# EAGLE design 16-pin SOIC+TSSOP (EAGLE 6.2)
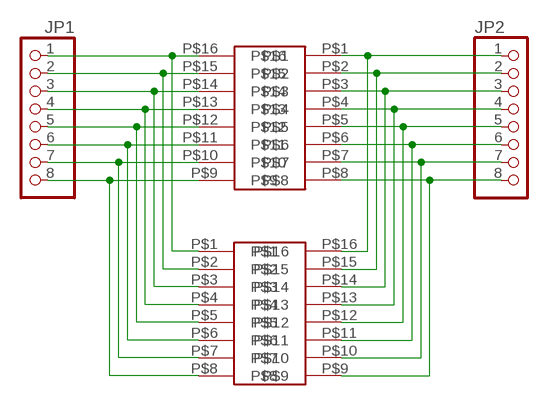
[diagram p0: schematic, sheet 1]

## Parts
JP1  PADS-8CLEANBIG  [PADS-8]
JP2  PADS-8CLEANBIG  [PADS-8]
U$1  16-PINSOIC-NW  [SO16-NW]
U$2  16-PINTSSOP-NW  [TSSOP16-NW]

## Nets
N$1: JP1.1 U$1.P$1 U$2.P$16
N$2: JP1.2 U$1.P$2 U$2.P$15
N$3: JP1.3 U$1.P$3 U$2.P$14
N$4: JP1.4 U$1.P$4 U$2.P$13
N$6: JP1.6 U$1.P$6 U$2.P$11
N$7: JP1.7 U$1.P$7 U$2.P$10
N$8: JP1.8 U$1.P$8 U$2.P$9
N$9: JP2.1 U$1.P$16 U$2.P$1
N$10: JP2.2 U$1.P$15 U$2.P$2
N$11: JP2.3 U$1.P$14 U$2.P$3
N$12: JP2.4 U$1.P$13 U$2.P$4
N$13: JP2.5 U$1.P$12 U$2.P$5
N$14: JP2.6 U$1.P$11 U$2.P$6
N$15: JP2.7 U$1.P$10 U$2.P$7
N$16: JP2.8 U$1.P$9 U$2.P$8
N$17: JP1.5 U$1.P$5 U$2.P$12

## Library data of the parts
JP1 JP2 = breakouts:PADS-8: PIN HEADER
U$1 U$2 = breakouts:16-PIN

## Board
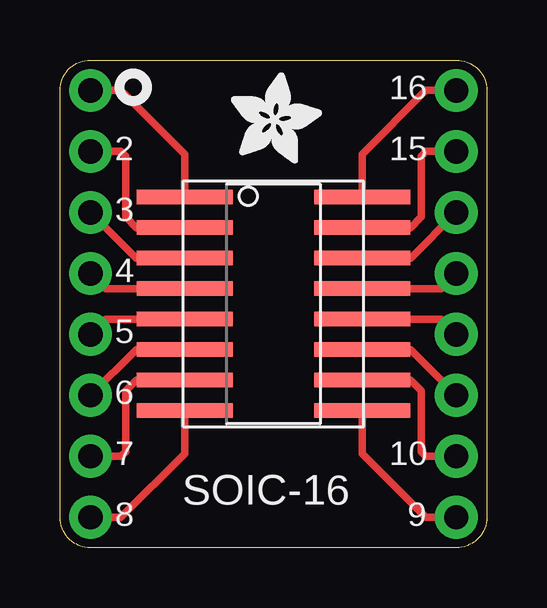
[diagram p1: board, top side]
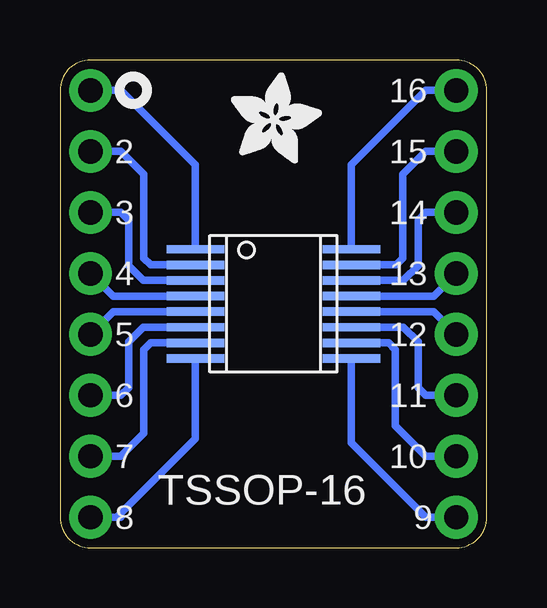
[diagram p2: board, bottom side, seen from below]

Size 17.78 x 20.32 mm. Coordinates in mm from the lower left corner, seen from the top.
Outline: 0,1.27 0,19.05 arc-90 1.27,20.32 16.51,20.32 arc-90 17.78,19.05 17.78,1.27 arc-90 16.51,0 1.27,0 arc-90 0,1.27
Copper layers (1*16): Top 0.035mm / dielectric 1.5mm / Bottom 0.035mm
Design rules: minimum track width 10mil, minimum drill 16mil, track to track 8mil, track to pad 8mil, pad to pad 8mil, via to via 8mil, smd to smd 8mil, copper to edge 10mil, drill to drill 8mil, minimum pad ring 10mil, minimum via ring 8mil, stop-mask expansion 4mil, vias tented up to drill 20mil, thermal gap 10mil

### Footprints (pad centres in the part's own frame; a part is rotated, then mirrored left to right if it is on the bottom)
PADS-8 = drill 1.016 pad 1.778: 1 -8.89,0; 2 -6.35,0; 3 -3.81,0; 4 -1.27,0; 5 1.27,0; 6 3.81,0; 7 6.35,0; 8 8.89,0
SO16-NW = smd 4 x 0.6: P$1 -3.7,4.445; P$2 -3.7,3.175; P$3 -3.7,1.905; P$4 -3.7,0.635; P$5 -3.7,-0.635; P$6 -3.7,-1.905; P$7 -3.7,-3.175; P$8 -3.7,-4.445; P$9 3.7,-4.445; P$10 3.7,-3.175; P$11 3.7,-1.905; P$12 3.7,-0.635; P$13 3.7,0.635; P$14 3.7,1.905; P$15 3.7,3.175; P$16 3.7,4.445
TSSOP16-NW = smd 2.4 x 0.35: P$1 -3.25,2.275; P$2 -3.25,1.625; P$3 -3.25,0.975; P$4 -3.25,0.325; P$5 -3.25,-0.325; P$6 -3.25,-0.975; P$7 -3.25,-1.625; P$8 -3.25,-2.275; P$9 3.25,-2.275; P$10 3.25,-1.625; P$11 3.25,-0.975; P$12 3.25,-0.325; P$13 3.25,0.325; P$14 3.25,0.975; P$15 3.25,1.625; P$16 3.25,2.275

### Placement (x,y rotation side)
JP1  1.27,10.16 270 top
JP2  16.51,10.16 270 top
U$1  8.89,10.16 0 top
U$2  8.89,10.16 0 bottom
U$3  [ADAFRUIT_3.5MM]  7.11,16 0 top
U$4  [ADAFRUIT_3.5MM]  10.67,16 0 bottom

### Tracks (layer width: path | path; a pad name or v marks a point on that pad's centre or on a via)
N$1
  Top 0.305: U$1.P$1 5.19,16.4 2.54,19.05 JP1.1
  Bottom 0.305: JP1.1 2.54,19.05 5.64,15.95 U$2.P$16
N$2
  Top 0.305: U$1.P$2 3.17,13.34 2.73,13.78 2.73,16.32 2.54,16.51 JP1.2
  Bottom 0.305: U$2.P$15 3.77,11.79 3.49,12.06 3.49,15.56 2.54,16.51 JP1.2
N$3
  Top 0.305: U$1.P$3 3.17,12.06 JP1.3
  Bottom 0.305: U$2.P$14 3.47,11.13 2.86,11.75 2.86,13.65 2.54,13.97 JP1.3
N$4
  Top 0.305: U$1.P$4 1.91,10.79 JP1.4
  Bottom 0.305: U$2.P$13 2.21,10.48 JP1.4
N$6
  Top 0.305: U$1.P$6 3.17,8.26 JP1.6
  Bottom 0.305: U$2.P$11 3.47,9.19 2.86,8.57 2.86,6.67 2.54,6.35 JP1.6
N$7
  Top 0.305: U$1.P$7 3.17,6.99 2.73,6.54 2.73,4 2.54,3.81 JP1.7
  Bottom 0.305: U$2.P$10 4.09,8.54 3.81,8.26 3.81,5.08 2.54,3.81 JP1.7
N$8
  Top 0.305: U$1.P$8 5.19,3.92 2.54,1.27 JP1.8
  Bottom 0.305: JP1.8 2.54,1.27 5.64,4.37 U$2.P$9
N$9
  Top 0.305: U$1.P$16 12.59,16.4 15.24,19.05 JP2.1
  Bottom 0.305: JP2.1 15.24,19.05 12.14,15.95 U$2.P$1
N$10
  Top 0.305: U$1.P$15 14.61,13.34 15.05,13.78 15.05,16.32 15.24,16.51 JP2.2
  Bottom 0.305: U$2.P$2 14.01,11.79 14.29,12.06 14.29,15.56 15.24,16.51 JP2.2
N$11
  Top 0.305: U$1.P$14 14.61,12.06 JP2.3
  Bottom 0.305: U$2.P$3 14.31,11.13 14.92,11.75 14.92,13.65 15.24,13.97 JP2.3
N$12
  Top 0.305: U$1.P$13 15.88,10.79 JP2.4
  Bottom 0.305: U$2.P$4 15.56,10.48 JP2.4
N$13
  Top 0.305: U$1.P$12 15.88,9.53 JP2.5
  Bottom 0.305: U$2.P$5 15.56,9.84 JP2.5
N$14
  Top 0.305: U$1.P$11 14.61,8.26 JP2.6
  Bottom 0.305: U$2.P$6 14.31,9.19 14.92,8.57 14.92,6.67 15.24,6.35 JP2.6
N$15
  Top 0.305: U$1.P$10 14.61,6.99 15.05,6.54 15.05,4 15.24,3.81 JP2.7
  Bottom 0.305: U$2.P$7 14.01,8.54 14.29,8.26 14.29,4.76 15.24,3.81 JP2.7
N$16
  Top 0.305: U$1.P$9 12.59,3.92 15.24,1.27 JP2.8
  Bottom 0.305: 15.24,1.27 15.42,1.27 | 15.42,1.27 JP2.8 | U$2.P$8 12.14,4.55 15.42,1.27
N$17
  Top 0.305: U$1.P$5 1.91,9.53 JP1.5
  Bottom 0.305: U$2.P$12 2.21,9.84 JP1.5

### Text on the board
tPlace: 16 | 2 | 15 | 3 | 4 | 5 | 6 | 7 | 10 | SOIC-16 | 8 | 9
bPlace: 16 | 15 | 2 | 14 | 3 | 13 | 4 | 12 | 5 | 11 | 6 | 10 | 7 | TSSOP-16 | 9 | 8
tValues: SOIC-16
bValues: TSSOP-16